# Altium project Heater_Cable.PrjPcb
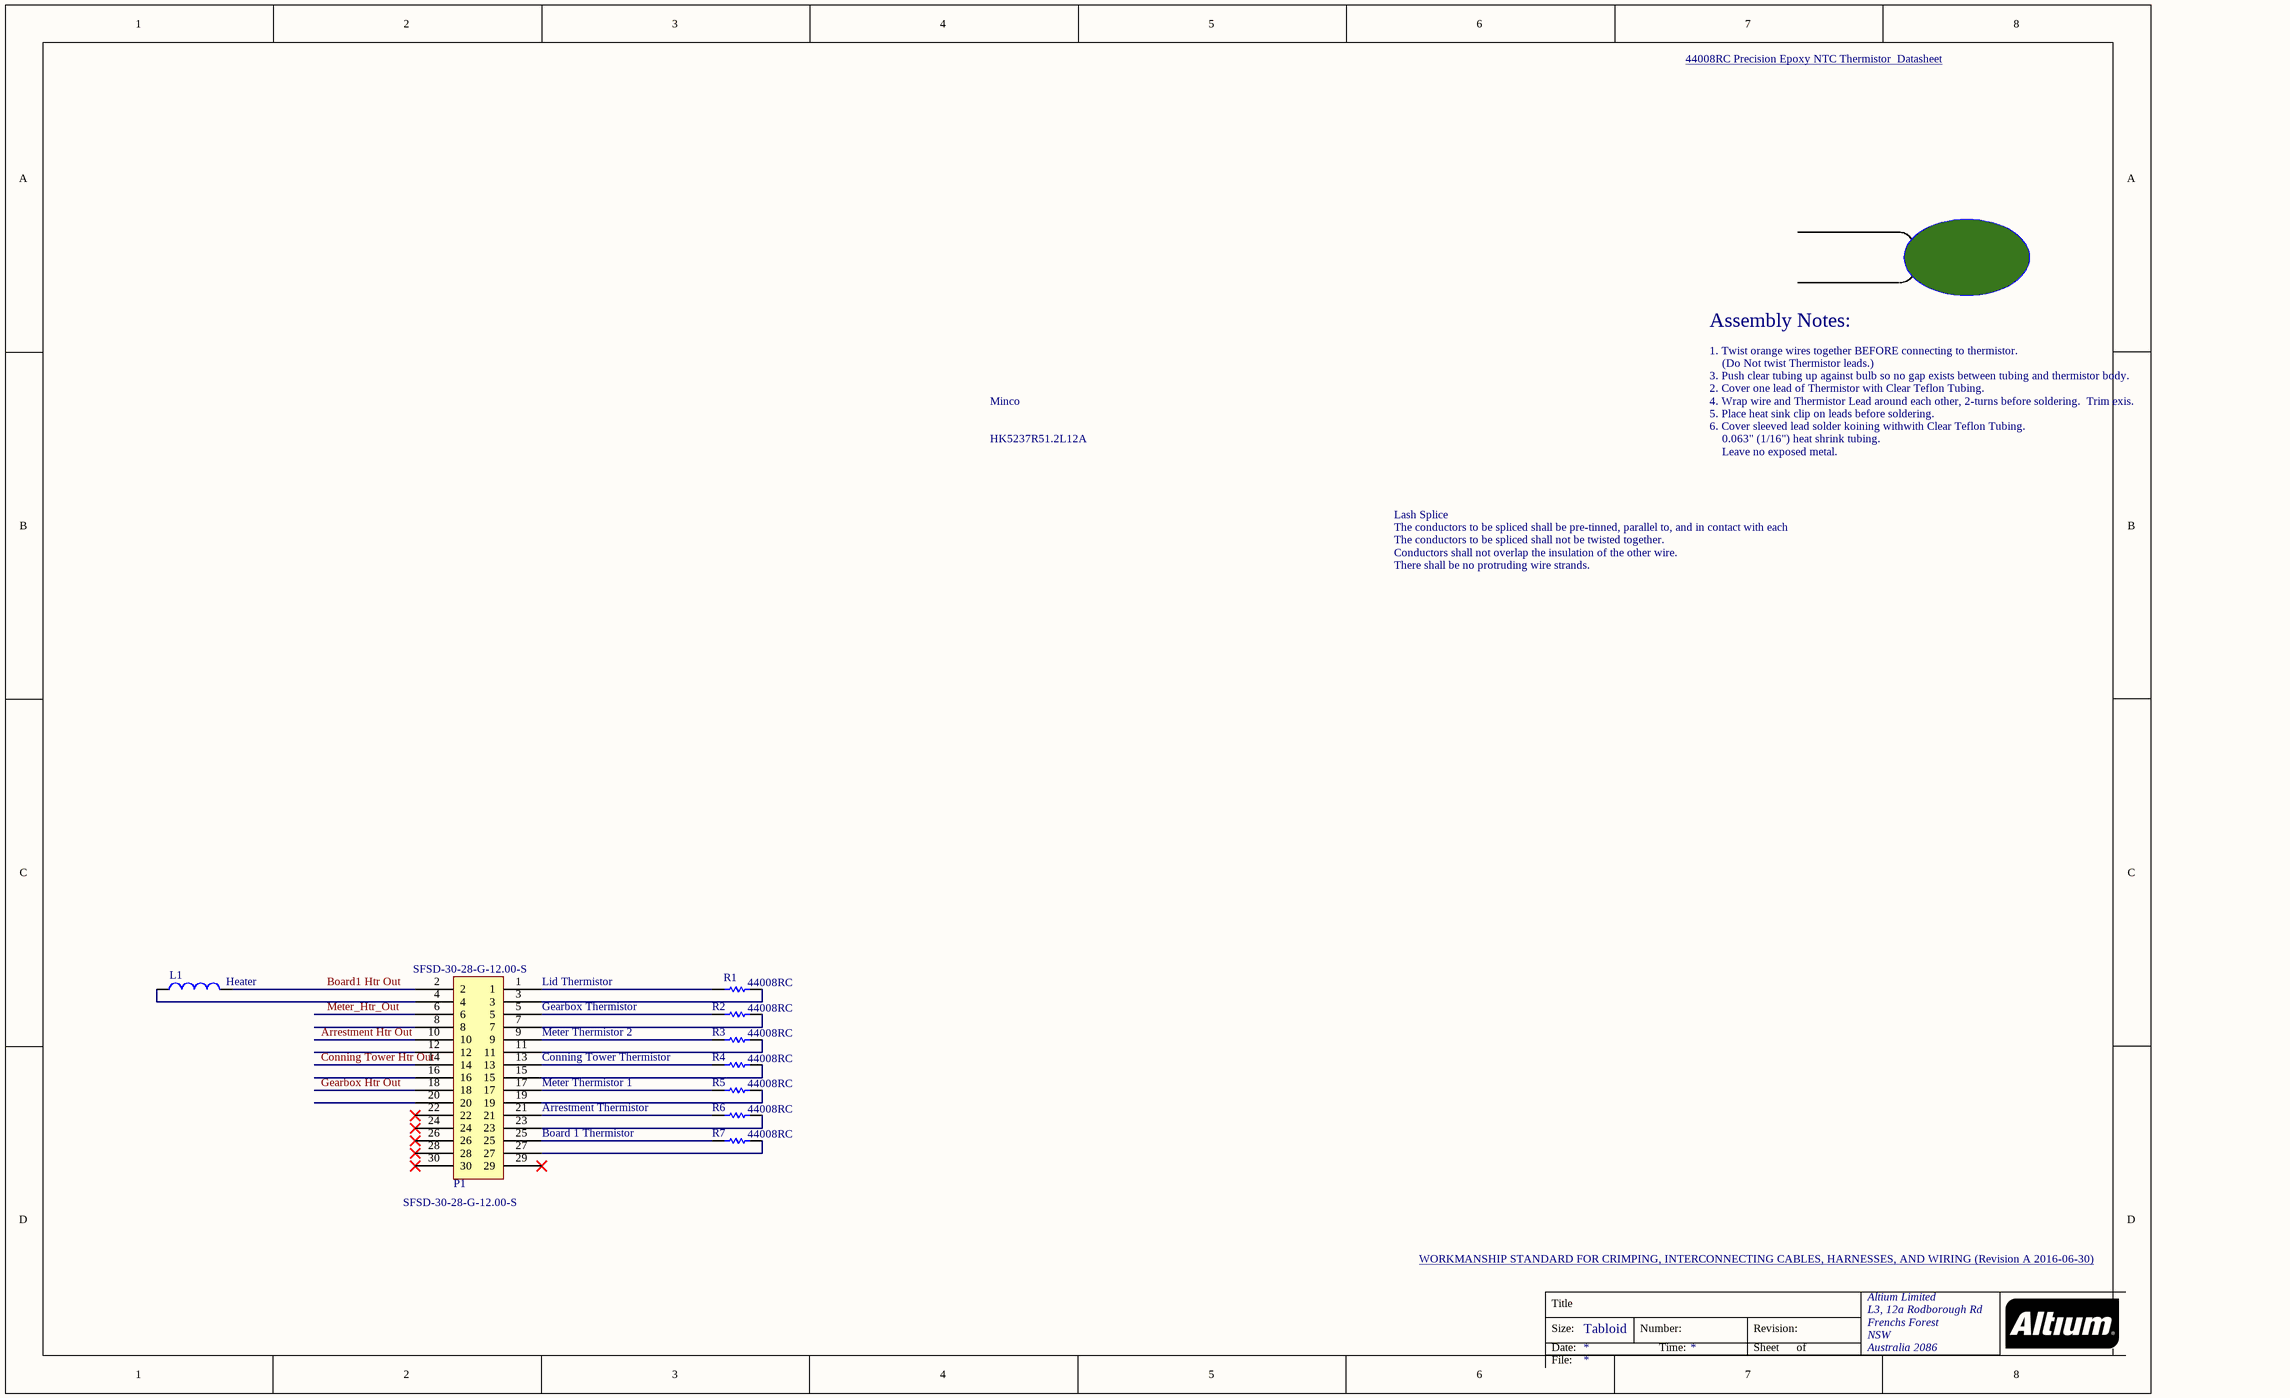
[diagram p0: HC-001.SchDoc]
1 sheet, 9 parts. Net scope: global (net labels, ports and power ports of the same name join across sheets).
Board file: HC-001.PcbDoc

## Sheet HC-001.SchDoc
size Tabloid; Organization: Altium Limited; Address1: L3, 12a Rodborough Rd; Address2: Frenchs Forest; Address3: NSW; Address4: Australia 2086

### Parts
L1  Heater  [0402-A]
P1  SFSD-30-28-G-12.00-S  [SFSD-30-28]
R1  44008RC  [RESC0805(2012)_N]
R2  44008RC  [RESC0805(2012)_N]
R3  44008RC  [RESC0805(2012)_N]
R4  44008RC  [RESC0805(2012)_N]
R5  44008RC  [RESC0805(2012)_N]
R6  44008RC  [RESC0805(2012)_N]
R7  44008RC  [RESC0805(2012)_N]

### Nets
Arrestment Htr Out: P1.10
Board1 Htr Out: L1.2 P1.2
Conning Tower Htr Out: P1.14
Gearbox Htr Out: P1.18
Meter_Htr_Out: P1.6
NetL1_1: L1.1 P1.4
NetP1_1: P1.1 R1.1
NetP1_3: P1.3 R1.2
NetP1_5: P1.5 R2.1
NetP1_7: P1.7 R2.2
NetP1_9: P1.9 R3.1
NetP1_11: P1.11 R3.2
NetP1_13: P1.13 R4.1
NetP1_15: P1.15 R4.2
NetP1_17: P1.17 R5.1
NetP1_19: P1.19 R5.2
NetP1_21: P1.21 R6.1
NetP1_23: P1.23 R6.2
NetP1_25: P1.25 R7.1
NetP1_27: P1.27 R7.2

Not connected (* = marked no-connect by the designer): P1 8 12 16 20 22* 24* 26* 28* 29* 30*

### Notes on the sheet
- 44008RC Precision Epoxy NTC Thermistor  Datasheet
- Assembly Notes:
- Minco
- 1. Twist orange wires together BEFORE connecting to thermistor.
- 2. Cover one lead of Thermistor with Clear Teflon Tubing.
- 3. Push clear tubing up against bulb so no gap exists between tubing and thermistor body.
- 4. Wrap wire and Thermistor Lead around each other, 2-turns before soldering.  Trim exis.
- (Do Not twist Thermistor leads.)
- HK5237R51.2L12A
- 5. Place heat sink clip on leads before soldering.
- 6. Cover sleeved lead solder koining withwith Clear Teflon Tubing.
- 0.063" (1/16") heat shrink tubing.
- Leave no exposed metal.
- Lash Splice
- The conductors to be spliced shall be pre-tinned, parallel to, and in contact with each
- The conductors to be spliced shall not be twisted together.
- Conductors shall not overlap the insulation of the other wire.
- There shall be no protruding wire strands.
- (near P1) Gearbox Thermistor
- (near P1) Lid Thermistor
- (near P1) Meter Thermistor 2
- Conning Tower Thermistor
- (near P1) Meter Thermistor 1
- (near P1) Arrestment Thermistor
- (near P1) Board 1 Thermistor
- (near P1) SFSD-30-28-G-12.00-S
- WORKMANSHIP STANDARD FOR CRIMPING, INTERCONNECTING CABLES, HARNESSES, AND WIRING (Revision A 2016-06-30)
- Title
- Size:
- Date:
- Tabloid
- Number:
- Time:
- Revision:
- Sheet
- of
- File:

### Library data of the parts
L1 = Inductor: Manufacturer Part Number: HK5237R51.2L12A; Manufacturer: Minco
P1 = TFM-115-01-L-D-RE2-WT: 60 Position Cable Assembly Rectangular Socket to Individual Wire Leads 1.00' (304.80mm); Manufacturer: Samtec; Manufacturer Part Number: SFSD-30-28-H-10.00-SR; System: Connector; Wire/Cable Type: Discrete; Gender: Female; Connector Type: Wire Leads,Socket,Crimp,Discrete Wire; Shielding: Unshielded; Number of Positions: 60; Cable Length: 0.254m; Connector Pitch: 0.05inch; Supplier 1: Mouser; Supplier Part Number 1: 200-SFSD3028H1000SR; Stock 1: 0; Pricing 1: 1=20.93000, 10=20.18000, 50=19.06000, 100=18.69000, 1000=18.32000, 10000=18.32000 (USD); RoHS: Yes; Contact Plating: Gold; Color: Black; Packaging: Bulk; Termination: Crimp; Package Quantity: 500; Number of Rows: 2; Length: 0.833foot; Radiation Hardening: No; ComponentLink1URL: https://datasheet.ciiva.com/45/sfsdx-xx-xxx-xx-xx-xx-xx-xxx-mkt-45178.pdf?src-supplier=Digi-Key; ComponentLink1Description: https://datasheet.ciiva.com/45/sfsdx-xx-xxx-xx-xx-xx-xx-xxx-mkt-45178.pdf?src-supplier=Digi-Key; ComponentLink2URL: https://datasheet.ciiva.com/11065/sfss-11065544.pdf?src-supplier=Avnet; ComponentLink2Description: https://datasheet.ciiva.com/11065/sfss-11065544.pdf?src-supplier=Avnet
R1-R7 = CMP-1013-00606-1: Manufacturer: Measurement Specialties; Resistance: 30kR; Tolerance: 0.8%; Lead Diameter: 2.4mm; Supplier 1: Future Electronics; Supplier Part Number 1: 44008RC; Manufacturer Part Number: 44008RC; Stock 1: 0; Mount: Through Hole; Case/Package: Radial; Number of Pins: 2; Min Operating Temperature: 0°C; Max Operating Temperature: 70°C; Packaging: Tape and Reel; Termination: Radial; Package Quantity: 100; Radiation Hardening: No; REACH SVHC: No SVHC; Lead Free: Lead Free; ComponentLink1URL: http://www.mouser.com/ds/2/418/44008-710102.pdf?src-supplier=Mouser; ComponentLink1Description: http://www.mouser.com/ds/2/418/44008-710102.pdf?src-supplier=Mouser; ComponentLink2URL: http://www.meas-spec.com/downloads/44008.pdf?src-supplier=Future+Electronics; ComponentLink2Description: http://www.meas-spec.com/downloads/44008.pdf?src-supplier=Future+Electronics